# Altium schematic sheet Sheet2.SchDoc
size A4
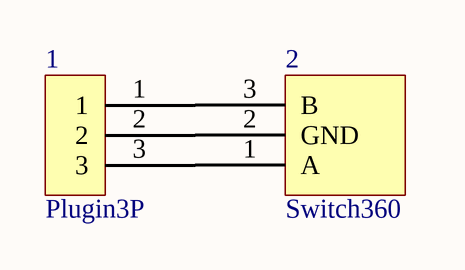
[diagram p0: Sheet2.SchDoc]

## Parts
1  Plugin3P  [Plugin3P]
2  Switch360  [Switch360]

## Nets
Net1_1: 1.1 2.3(B)
Net1_2: 1.2 2.2(GND)
Net1_3: 1.3 2.1(A)